# Altium schematic sheet Gate Drivers.SchDoc
size Letter; DocumentNumber: 2; SheetNumber: 2; SheetTotal: 3
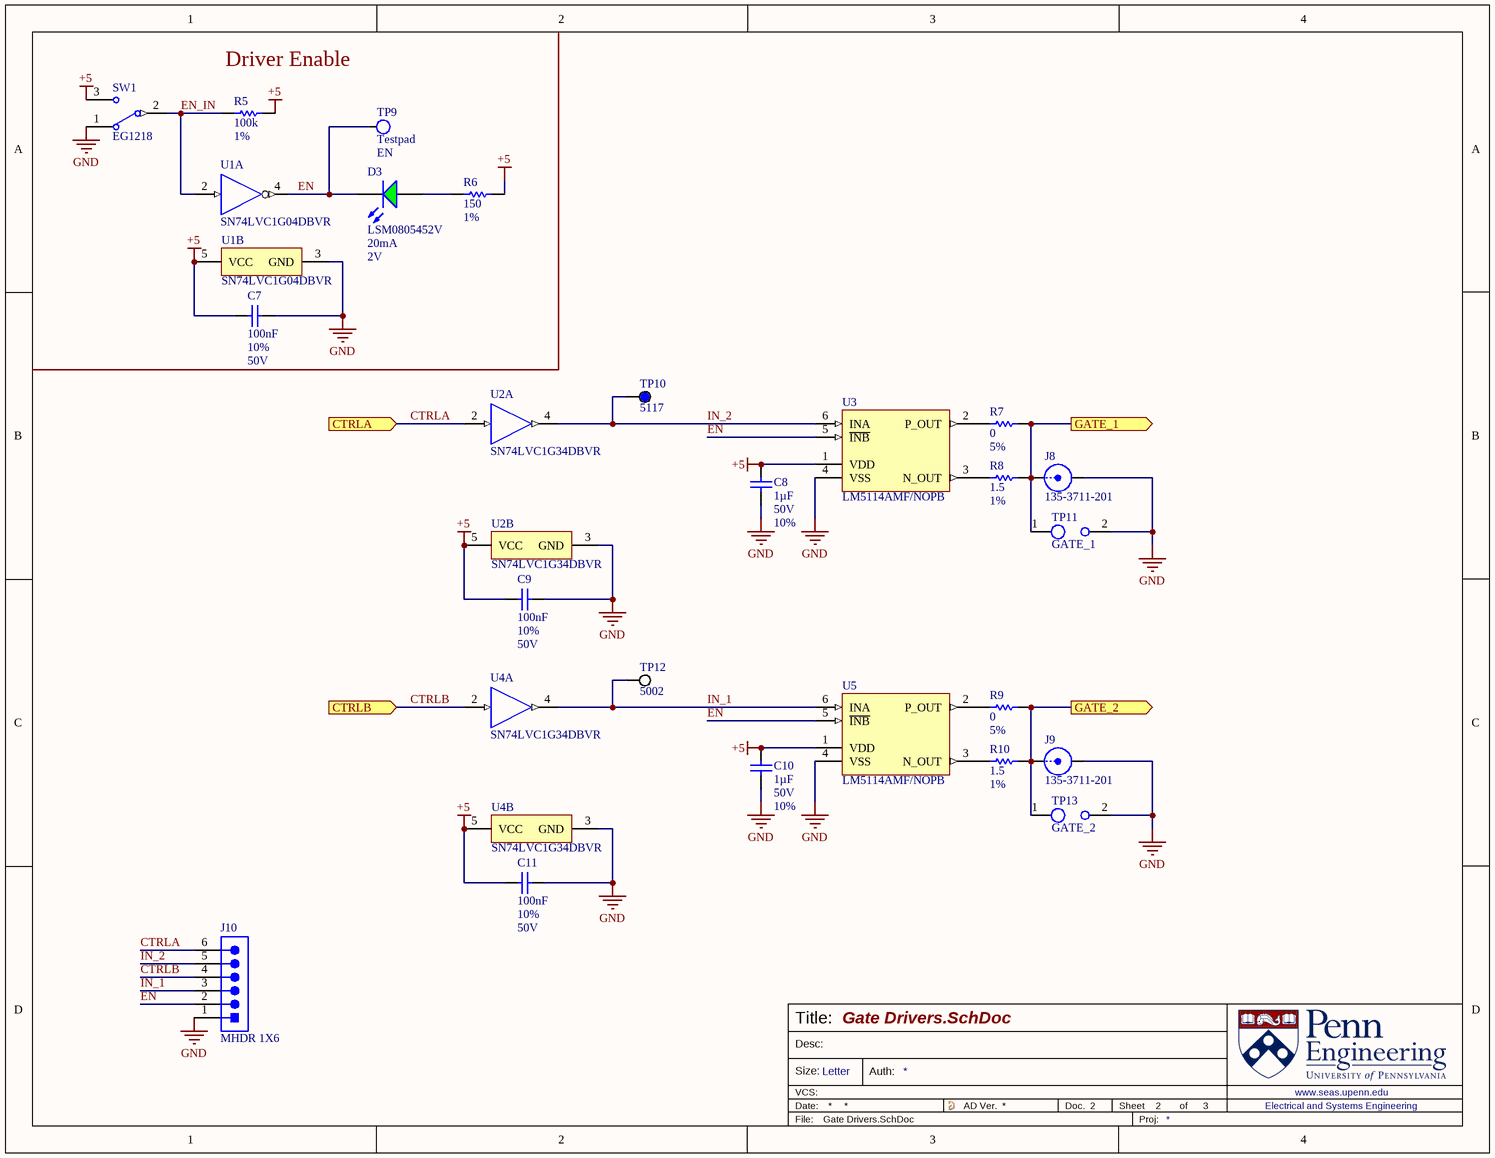
[diagram p0: Gate Drivers.SchDoc]

## Parts
C7  value 100nF  Tolerance: 10%  Voltage: 50V  [0805_CAP]  (hidden comment: CAP 0805 0.1UF 50V 10% X7R)
C8  value 1µF  Voltage: 50V  Tolerance: 10%  [1206_CAP]  (hidden comment: CAP 1206 1.0UF 50V 10% X7R)
C9  value 100nF  Tolerance: 10%  Voltage: 50V  [0805_CAP]  (hidden comment: CAP 0805 0.1UF 50V 10% X7R)
C10  value 1µF  Voltage: 50V  Tolerance: 10%  [1206_CAP]  (hidden comment: CAP 1206 1.0UF 50V 10% X7R)
C11  value 100nF  Tolerance: 10%  Voltage: 50V  [0805_CAP]  (hidden comment: CAP 0805 0.1UF 50V 10% X7R)
D3  LSM0805452V  Current: 20mA  Forward Voltage: 2V  [LED_0805]
J8  135-3711-201  [135-3711-201-Vias-Footprint-1]
J9  135-3711-201  [135-3711-201-Vias-Footprint-1]
J10  MHDR 1X6  [MHDR 1X6]
R5  value 100k  Tolerance: 1%  [0805_RES]  (hidden comment: RES 0805 100K 1%)
R6  value 150  Tolerance: 1%  [0805_RES]  (hidden comment: RES 0805 150 1%)
R7  value 0  Tolerance: 5%  [0603_RES]  (hidden comment: RES 0603 0 5%)
R8  value 1.5  Tolerance: 1%  [0603_RES]  (hidden comment: RES 0603 1.5 1%)
R9  value 0  Tolerance: 5%  [0603_RES]  (hidden comment: RES 0603 0 5%)
R10  value 1.5  Tolerance: 1%  [0603_RES]  (hidden comment: RES 0603 1.5 1%)
SW1  EG1218  [ESWI-EG1218_V]
TP9  Testpad  NetName: EN  [Test PTH 15-30]  (no BOM)
TP10  5117  [KSTN-5117]
TP11  NetName: GATE_1  [No Silk Test Point - Scope with Ground Spring-Footprint-1]  (hidden comment: Test Point - Scope with Ground Spring (No Socket))  (no BOM)
TP12  5002  [KSTN-5002]
TP13  NetName: GATE_2  [No Silk Test Point - Scope with Ground Spring-Footprint-1]  (hidden comment: Test Point - Scope with Ground Spring (No Socket))  (no BOM)
U1  SN74LVC1G04DBVR  [DBV0005A_N]  (parts A,B of 2)
U2  SN74LVC1G34DBVR  [DBV0005A_N]  (parts A,B of 2)
U3  LM5114AMF/NOPB  [DBV0006A_N]
U4  SN74LVC1G34DBVR  [DBV0005A_N]  (parts A,B of 2)
U5  LM5114AMF/NOPB  [DBV0006A_N]

## Ports
CTRLA (in), CTRLB (in), GATE_1 (out), GATE_2 (out)

## Nets
+5: C7.1 C8.2 C9.1 C10.2 C11.1 R5.2 R6.2 SW1.3 U1.5(VCC) U2.5(VCC) U3.1(VDD) U4.5(VCC) U5.1(VDD)
GND: C7.2 C8.1 C9.2 C10.1 C11.2 J8.2(SHELL) J9.2(SHELL) J10.1 SW1.1 TP11.2(GND) TP13.2(GND) U1.3(GND) U2.3(GND) U3.4(VSS) U4.3(GND) U5.4(VSS)
CTRLA: J10.6 U2.2(A) ; port CTRLA
CTRLB: J10.4 U4.2(A) ; port CTRLB
EN: D3.K J10.2 TP9.1 U1.4(Y) U3.5(~{INB}) U5.5(~{INB})
EN_IN: R5.1 SW1.2(COM) U1.2(A)
GATE_1: J8.1 R7.2 R8.2 TP11.1(Signal) ; port GATE_1
GATE_2: J9.1 R9.2 R10.2 TP13.1(Signal) ; port GATE_2
IN_1: J10.3 TP12.1 U4.4(Y) U5.6(INA)
IN_2: J10.5 TP10.1 U2.4(Y) U3.6(INA)
NetD3_A: D3.A R6.1
NetR7_1: R7.1 U3.2(P_OUT)
NetR8_1: R8.1 U3.3(N_OUT)
NetR9_1: R9.1 U5.2(P_OUT)
NetR10_1: R10.1 U5.3(N_OUT)

Not connected (* = marked no-connect by the designer): U1 1(NC); U2 1(NC); U4 1(NC)

## Notes on the sheet
- Driver Enable
- Title:
- Desc:
- Size:
- Letter
- Auth:
- Sheet
- of
- www.seas.upenn.edu
- Electrical and Systems Engineering
- Proj:

## Library data of the parts
C7 C9 C11 = CMP-011-000431-5: Capacitor Surface Mount 0805 Footprint 0.1UF 50V 10% Tolerance Ceramic X7R; Manufacturer: Various; Description in Visual: Cap SMT 0805 0.1UF 50V 10%  Cer X7R; PCB Package: 0805; Capacitor Type: Ceramic; Type: Ceramic X7R; RoHS: Yes; Case/Package: 0805; Pins: 2; P/N: CAP 0805 0.1UF 50V 10% X7R; Mount: SMT; Manufacturer P/N: CAP 0805 0.1UF 50V 10% X7R
C8 C10 = CMP-011-000623-2: Capacitor Surface Mount 1206 Footprint 1.0UF 50V 10% Tolerance Ceramic X7R; Manufacturer: Various; PCB Package: 1206; Description in Visual: Cap SMT 1206 1.0UF 50V 10%  Cer X7R; Manufacturer P/N: CAP 1206 1.0UF 50V 10% X7R; Case/Package: 1206; Mount: SMT; P/N: CAP 1206 1.0UF 50V 10% X7R; RoHS: Yes; Capacitor Type: Ceramic; Type: Ceramic X7R
D3 = CMP-00038-4: Single Color LED, Green, 0805; Wavelength - Peak: 571nm; Package (Case): 0805; RoHS Compliant: Yes; Wavelength - Dominant: 571nm; Color: Green; Test Current: 20mA
J8 J9 = CMP-00804-2: RF / Coaxial Connector, MMCX Coaxial, Straight Jack, Surface Mount Straight, 50 ohm; Manufacturer Lifecycle Status: PRODUCTION; Connector Type: Coaxial, MMCX, Socket; Voltage Rating: 170V; Gender: Female; Number of Ports: 1; Insulation Resistance: 1GΩ; Insertion Loss (dB): 0.1dB; Body Plating: Copper, Gold; Dielectric Material: PTFE; Contact Resistance: 8mΩ; Body Material: Brass; Plating: Gold; Impedance: 50Ω; Operating Force: 35.584N; Frequency: 6GHz; Housing Material: Brass; Shell Material: Brass; RoHS: Compliant; Length: 5.0038mm; Orientation: Straight; Packaging: Box; Contact Plating: Gold; Contact Gender: Female; Fastening Type: Snap; Mounting Technology: PCB, Surface Mount; Number of Positions: 1; Termination: Solder; Radiation Hardening: No; Contact Material: Copper; Insulation Material: PTFE; Min Operating Temperature: -55°C; China RoHS: Compliant; Lifecycle Status: Production; Housing Color: Gold; Lead Free: Lead Free; REACH SVHC: No; Clock Frequency: 6GHz; Pins: 1; Max Operating Temperature: 155°C
J10 = CMP-00091-3: Header, 6-Pin, 0.1in Pitch, Male; Reliability: COMMERCIAL; Mounting Option 1: LOCKING; Number of Contacts: 6; Rated Current (Signal): 3A; Contact Pattern: RECTANGULAR; Number Of Connectors: 1; Connector Type: BOARD CONNECTOR; Mating Contact Pitch: 0.1inch; Body/Shell Style: PLUG; Contact Resistance: 20mR; Pitch: 0.1 inch; Contact Style: SQ PIN-SKT; Body Length: 0.6inch; Insulation Resistance: 1GR; Dielectric Withstanding Voltage (AC): 500V; Reference Standard: UL; Max Operating Temperature: 125°C; Contact Finish - Mating: GOLD; Terminal Length: 0.118inch; Mounting Style: STRAIGHT; Body Breadth: 0.1inch; JESD-609 Code: e4; Min Operating Temperature: -40°C; Contact Material: Copper Alloy; Terminal Pitch: 2.54mm; PCB Contact Pattern: RECTANGULAR; Mounting Technology: Board; Contact Gender: Male; JLCPCB Part #: C178289; Insulation Material: Polybutylene; Insulation Color: Black; Reach SVHC Compliant: Yes; Body Depth: 0.1inch; RoHS Compliant: Yes; Number of Rows Loaded: 1; Contact Finish - Termination: Gold (Au) - with Nickel (Ni) barrier; Termination: Solder
R5 = CMP-005-004027-2: Resistor Surface Mount, 100K Ohms, 0805 Footprint, 1% Tolerance 0.125W; Manufacturer: Various; Description in Visual: Res SMT 100K 0805  1%  0.125W; PCB Package: 0805; Power Rating: 0.125W; Mount: SMT; Manufacturer P/N: RES 0805 100K 1%
R6 = CMP-005-004245-3: Resistor Surface Mount, 150 Ohms, 0805 Footprint, 1% Tolerance 0.125W; Manufacturer: Various; Manufacturer P/N: RES 0805 150R 1%; Description in Visual: Res SMT 150 0805  1%  0.125W; PCB Package: 0805; Power Rating: 0.125W; Mount: SMT
R7 R9 = CMP-005-001964-4: Resistor Surface Mount, 0 Ohms, 0603 Footprint, 5% Tolerance 0.1W; Manufacturer P/N: RES 0603 0R 5%; Manufacturer: Various; PCB Package: 0603; Description in Visual: Res SMT 0 0603  5%  0.1W; Power Rating: 0.1W; Mount: SMT; JLCPCB Part #: C21189
R8 R10 = CMP-00793-3: Resistor Surface Mount, 1.5 Ohms, 0603 Footprint, 1% Tolerance 0.1W; Manufacturer P/N: RES 0603 1R5 1%; Manufacturer: Various; PCB Package: 0603; Description in Visual: Res SMT 1.5R 0603  1%  0.1W; Power Rating: 0.1W; Mount: SMT
SW1 = CMP-00099-1: Slide Switch, 2 Positions, SPDT, Latched, 0.2A, 30VDC, 3 PCB Hole Cnt, Solder Terminal, Through Hole-straight; Body Length or Diameter: 11.6mm; Body Height: 5.4mm; Body Breadth: 4inch; Reach SVHC Compliant: Yes; RoHS Compliant: Yes; Switch Type: Slide Switch; Terminal Finish: Silver; JESD-609 Code: e4; Switch Action: LATCHED; Mounting Technology: Through Hole; Switch Function: SPDT; Max Operating Temperature: 70°C; Termination: Solder; Min Operating Temperature: -20°C
TP9 = CMP-00049-8: Test Pad/Point (Testpoint, Testpad), for probing
TP10 = CMP-024-000007-1: Test Point, Blue, 1-Pin THD, RoHS, Bulk; Brand: KeystoneElectronics; Plating: Silver; Mounting Hole Size: 1mm; Outside Diameter: 2.54mm; Pin Count: 1; Datasheet Version: Rev. G, 12/2008; Product: TestPoints; Datasheet URL: https://ciiva.com/datasheet-click-2917627?src=ciiva&sig=bd195616; Color: Blue; Length: 7.62mm; Type: Miniature; Product Category: CircuitBoardHardware-PCB; Component Type: Standard; Packaging: Bulk; Material: Nylon; RoHS: True; Contact Material: PhosphorBronze; Manufacturer URL: http://www.keyelco.com/; Source: Keystone 500x Series.SchLib; Manufacturer: KeystoneElectronics; Design Item ID: 5117
TP11 TP13 = CMP-00799-3: Testpoint for scope probe with a ground spring; Probe tip 0.032in-0.046in; 0.350in Ground Spring Clearance (placed at 0.3in)
TP12 = CMP-024-000002-1: Test Point, White, 1-Pin THD, RoHS, Bulk; Manufacturer: KeystoneElectronics; Mounting Hole Size: 1mm; Plating: Silver; Outside Diameter: 2.54mm; Product Category: CircuitBoardHardware-PCB; RoHS: True; Manufacturer URL: http://www.keyelco.com/; Packaging: Bulk; Source: Keystone 500x Series.SchLib; Component Type: Standard; Pin Count: 1; Material: Nylon; Datasheet Version: Rev. G, 12/2008; Design Item ID: 5002; Color: White; Product: TestPoints; Type: Miniature; Contact Material: PhosphorBronze; Datasheet URL: https://ciiva.com/datasheet-click-2917627?src=ciiva&sig=bd195616; Length: 7.62mm; Brand: KeystoneElectronics
U1 = CMP-082-000026-1: SINGLE INVERTER GATE Inverter, LVC/LCX/Z Series, 1-Func, 1-Input, CMOS, PDSO5; Manufacturer Lifecycle Status: ACTIVE; Number of Gates: 1; Turn-On Delay Time: 7.5ns; Max Supply Voltage: 5.5V; Min Supply Voltage: 1.65V; Logic Function: Inverting; Nominal Supply Current: 10µA; Propagation Delay: 3.7ns; High Level Output Current: -32mA; Low Level Output Current: 32mA; Frequency: 150MHz; Schmitt Trigger Input: No; Schedule B: 8542390000, 8542390000; Radiation Hardening: No; Length: 2.9mm; Number of Bits: 1; Min Operating Temperature: -40°C; Case/Package: SOT-23; Width: 1.6mm; Ambient Temperature Range High: 125°C; Contact Plating: Tin; RoHS: Compliant; REACH SVHC: No; Packaging: Cut Tape; Thickness: 1.2mm; Lifecycle Status: Production; Mounting Technology: Surface Mount; Number of Outputs: 1; Number of Channels: 1; Number of Elements: 1; Lead Free: Lead Free; Height: 1.45mm; Max Operating Temperature: 125°C; Quiescent Current: 10µA; Number of Inputs: 1; Pins: 5; Number of Circuits: 1; Weight: 15.790684mg; Termination: SMD/SMT; Max Output current: 32mA; Output Current: 32mA
U2 U4 = CMP-00787-1: 1 32mA 1.65V~5.5V 32mA 1 SOT-23-5 Buffer/Driver/Transceiver ROHS; Manufacturer Lifecycle Status: ACTIVE; Number of Gates: 1; Turn-On Delay Time: 9.9ns; Max Supply Voltage: 5.5V; Min Supply Voltage: 1.5V; Logic Function: Buffer, Inverting; Nominal Supply Current: 10µA; Propagation Delay: 3.9ns; High Level Output Current: -32mA; Max Junction Temperature (Tj): 150°C; Quiescent Current: 1µA; Polarity: Non-Inverting; Schedule B: 8542390000, 8542390000; Radiation Hardening: No; Length: 2.9mm; Number of Bits: 1; Min Operating Temperature: -40°C; Case/Package: SOT-23; Width: 1.6mm; Ambient Temperature Range High: 125°C; Contact Plating: Gold; RoHS: Compliant; REACH SVHC: No; Packaging: Cut Tape; Thickness: 1.2mm; Lifecycle Status: Production; Mounting Technology: Surface Mount; Number of Outputs: 1; Number of Bits per Element: 1; Number of Channels: 1; Low Level Output Current: 32mA; Number of Input Lines: 1; Number of Elements: 1; Lead Free: Lead Free; Height: 1.45mm; Number of Output Lines: 1; Max Operating Temperature: 125°C; Number of Inputs: 1; Pins: 5; Number of Circuits: 1
U3 U5 = CMP-00786-2: 7.6-A/1.3-A single channel gate driver with 4-V UVLO and split outputs 6-SOT-23 -40 to 125; Manufacturer Lifecycle Status: ACTIVE; Fall Time: 8ns; Number of Outputs: 2; Turn-Off Delay Time: 36ns; Value: 310mΩ; Max Output current: 7.6A; Rise Time: 3.2ns; Number of Drivers: 1; Nominal Supply Current: 1.3A; Min Supply Voltage: 4V; Max Supply Voltage: 12.6V; Case/Package: SOT-23; Lead Free: Lead Free; Lifecycle Status: Production; Turn-On Delay Time: 36ns; Length: 2.9mm; Height: 0m; Element Configuration: Single; Width: 1.6mm; Pins: 6; Mounting Technology: Surface Mount; Min Operating Temperature: -40°C; Max Operating Temperature: 125°C; RoHS: Compliant; Output Current: 7.6A; Thickness: 1.2mm; Channel Type: Single; Number of Channels: 1